# Altium schematic sheet cuk.SchDoc
size A4
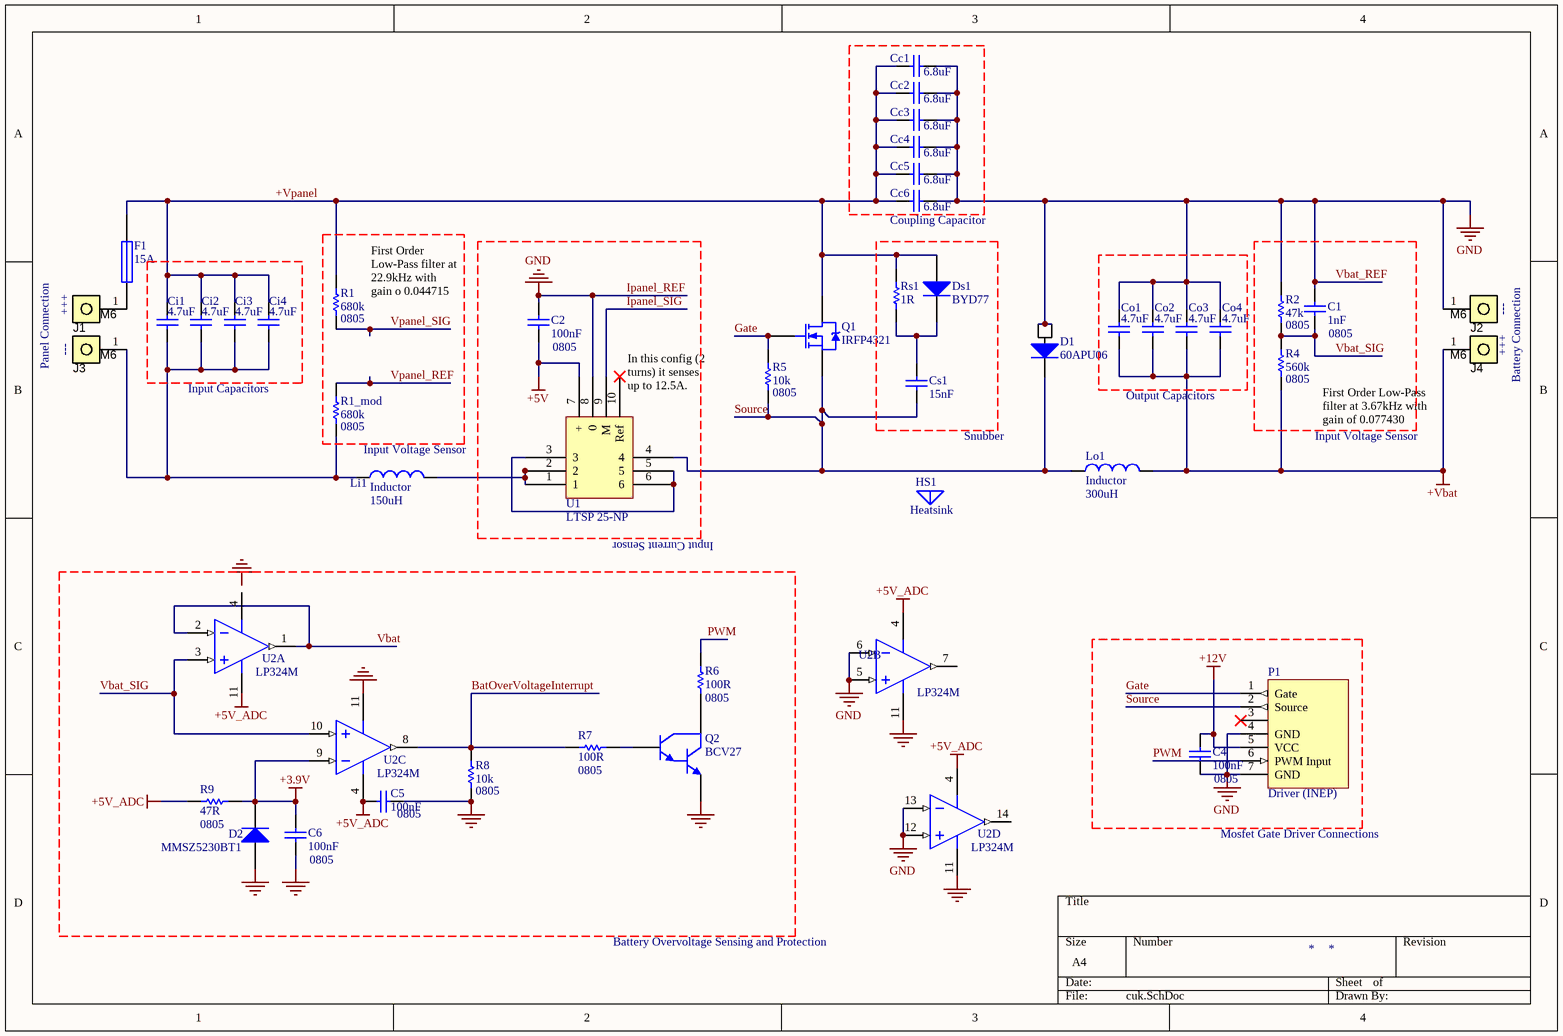
[diagram p0: cuk.SchDoc]

## Parts
C1  1nF  Footprint: 0805  [0805C]
C2  100nF  Footprint: 0805  [0805C]
C4  100nF  Footprint: 0805  [0805C]
C5  100nF  Footprint: 0805  [0805C]
C6  100nF  Footprint: 0805  [0805C]
Cc1  value 6.8uF  [CAP4U7 EPCOS]  (hidden comment: Cap)
Cc2  value 6.8uF  [CAP4U7 EPCOS]  (hidden comment: Cap)
Cc3  value 6.8uF  [CAP4U7 EPCOS]  (hidden comment: Cap)
Cc4  value 6.8uF  [CAP4U7 EPCOS]  (hidden comment: Cap)
Cc5  value 6.8uF  [CAP4U7 EPCOS]  (hidden comment: Cap)
Cc6  value 6.8uF  [CAP4U7 EPCOS]  (hidden comment: Cap)
Ci1  value 4.7uF  [cap4u7]  (hidden comment: Cap)
Ci2  value 4.7uF  [cap4u7]  (hidden comment: Cap)
Ci3  value 4.7uF  [cap4u7]  (hidden comment: Cap)
Ci4  value 4.7uF  [cap4u7]  (hidden comment: Cap)
Co1  4.7uF  [CAP4U7 EPCOS]
Co2  4.7uF  [CAP4U7 EPCOS]
Co3  4.7uF  [CAP4U7 EPCOS]
Co4  4.7uF  [CAP4U7 EPCOS]
Cs1  15nF  [100nF]
D1  60APU06  [to-247ac_horizontal]
D2  MMSZ5230BT1  [DSO-C2/X3.3]
Ds1  BYD77  [DSO-C2/X2.3]
F1  15A  [Porta Fusivel]
HS1  Heatsink  [HS10425]
J1  M6  Description: +++  [Parafuso]
J2  M6  Description: ---  [Parafuso]
J3  M6  Description: ---  [Parafuso]
J4  M6  Description: +++  [Parafuso]
Li1  Inductor  value 150uH  [NEE-42-20-DEITADO]
Lo1  Inductor  value 300uH  [NEE-42-20-DEITADO]
P1  Driver (INEP)  [Driver INEP]
Q1  IRFP4321  [to-247ac_horizontal]
Q2  BCV27  [SOT95P240-3N]
R1  680k  Type: 0805  [0805R]
R1_mod  680k  Type: 0805  [0805R]
R2  47k  Type: 0805  [0805R]
R4  560k  Type: 0805  [0805R]
R5  10k  Type: 0805  [0805R]
R6  100R  Type: 0805  [0805R]
R7  100R  Type: 0805  [0805R]
R8  10k  Type: 0805  [0805R]
R9  47R  Type: 0805  [0805R]
Rs1  1R  [AXIAL-0.3]
U1  LTSP 25-NP  [LTSP 25-NP]
U2  LP324M  [SOIC14-150(50)]  (parts A,B,C,D of 4)

## Nets
+3.9V: C6.2 D2.2(K) R9.1 U2.9(IN3-)
+5V: C2.1 U1.7(+)
+5V_ADC: C5.2 R9.2 U2.4(V+)
+12V: C4.2 P1.5(VCC)
+Vbat: Co1.1 Co2.1 Co3.1 Co4.1 J4.1 Lo1.2 R4.1
Ipanel_REF: C1.2 C2.2 C4.1 C5.1 C6.1 Cc1.2 Cc2.2 Cc3.2 Cc4.2 Cc5.2 Cc6.2 Co1.2 Co2.2 Co3.2 Co4.2 D1.1(A) D1.3(A) D2.1(A) J2.1 P1.4(GND) P1.7(GND) Q2.3(E) R2.2 R8.1 U1.8(0) U2.5(IN2+) U2.6(IN2-) U2.11(GND) U2.12(IN4+) U2.13(IN4-)  [also labelled GND, Vbat_REF]
+Vpanel: Cc1.1 Cc2.1 Cc3.1 Cc4.1 Cc5.1 Cc6.1 Ci1.2 Ci2.2 Ci3.2 Ci4.2 Ds1.1(A) F1.1 Q1.2(D) R1.2 Rs1.2
BatOverVoltageInterrupt: R7.2 R8.2 U2.8(OUT3)
Gate: P1.1(Gate) Q1.1(G) R5.2
Ipanel_SIG: U1.9(M)
PWM: P1.6(PWM_Input) R6.1
Source: Cs1.1 D1.2(K) Lo1.1 P1.2(Source) Q1.3(S) R5.1 U1.4
Vbat: U2.1(OUT1) U2.2(IN1-)
Vbat_SIG: C1.1 R2.1 R4.2 U2.3(IN1+) U2.10(IN3+)
Vpanel_REF: R1_mod.2
Vpanel_SIG: R1.1
NetCi1_1: Ci1.1 Ci2.1 Ci3.1 Ci4.1 J3.1 Li1.1 R1_mod.1
NetCs1_2: Cs1.2 Ds1.2(K) Rs1.1
NetF1_2: F1.2 J1.1
NetLi1_2: Li1.2 U1.1 U1.2
NetQ2_1: Q2.1(C) R6.2
NetQ2_2: Q2.2(B) R7.1
NetU1_3: U1.3 U1.5 U1.6

Not connected (* = marked no-connect by the designer): P1 3*; U1 10(Ref)*; U2 7(OUT2) 14(OUT4)

## Notes on the sheet
- (near Cc6) Coupling Capacitor
- (near R1) First Order Low-Pass filter at 22.9kHz with gain o 0.044715
- Panel Connection
- Battery Connection
- Input Capacitors
- (near U1) In this config (2 turns) it senses up to 12.5A.
- Snubber
- Output Capacitors
- Input Voltage Sensor
- First Order Low-Pass filter at 3.67kHz with gain of 0.077430
- Input Current Sensor
- Mosfet Gate Driver Connections
- Battery Overvoltage Sensing and Protection
- Labels drawn without touching a wire or pin: +5V_ADC, GND

## Library data of the parts
C1 C2 C4-C6 = Cap: Capacitor; Type: smd
  C1: Value: 1nF
  C2 C4-C6: Value: 100nF
Cc1-Cc6 Co1-Co4 = Cap: Capacitor; Voltage: 250V
  Cc1-Cc6: Type: pth
  Co1-Co4: Value: 4.7uF; type: pth
Ci1-Ci4 = Cap: Capacitor; Voltage: 100V; Type: pth
Cs1 = Cap: Capacitor; Value: 15nF; type: pth
D1 = 60APU06: Type: pth
D2 = Diode: Zener smd 3.9V; Type: pth; Value: MMSZ5230BT1
Ds1 = Diode 1N4002: 1 Amp General Purpose Rectifier; Type: smd; value: BYD77
F1 = Fuse 1: Fuse 5x20; Type: 5x20; Value: 15A
HS1 = Antenna: Generic Antenna
J1-J4 = PIN_BIG: value: M6; type: Parafuso
P1 = Driver_INEP: Driver INEP (Soeiro); Type: header
Q1 = IRFP260: HEXFET Power MOSFET; Type: pth
Q2 = NPN1: NPN Darlington Bipolar Transistor; Type: smd; Value: BCV27
R1 R1_mod R2 R4-R9 Rs1 = Res1: Resistor
  R1 R1_mod: Value: 680k
  R2: Value: 47k
  R4: Value: 560k
  R5 R8: Value: 10k
  R6 R7: Value: 100R
  R9: Value: 47R
  Rs1: Value: 1R; type: pth
U1 = LTSP 25-NP: Current Transducer LTSP (25 A); Type: pth
U2 = LP324M: Micropower Quad Operational Amplifier; Type: smd
Li1 Lo1 = Inductor: Type: pth